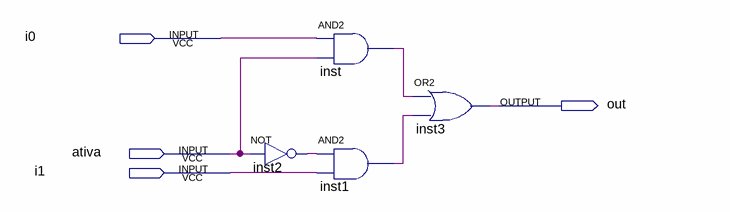
[diagram p0: schematic sheet]
// Quartus schematic mux2.bdf as structural Verilog: 4 symbols, 4 pins
module mux2 (
  input  i0,
  input  ativa,
  input  i1,
  output out
);

  wire inst1_out, inst2_out, inst_out;

  and inst (inst_out, i0, ativa);
  and inst1 (inst1_out, inst2_out, i1);
  not inst2 (inst2_out, ativa);
  or inst3 (out, inst_out, inst1_out);
endmodule
